# Altium schematic sheet [02]_Sensors Sheet.SchDoc
size 457 x 254 mm; DocumentNumber: 2; SheetNumber: 2; SheetTotal: 5
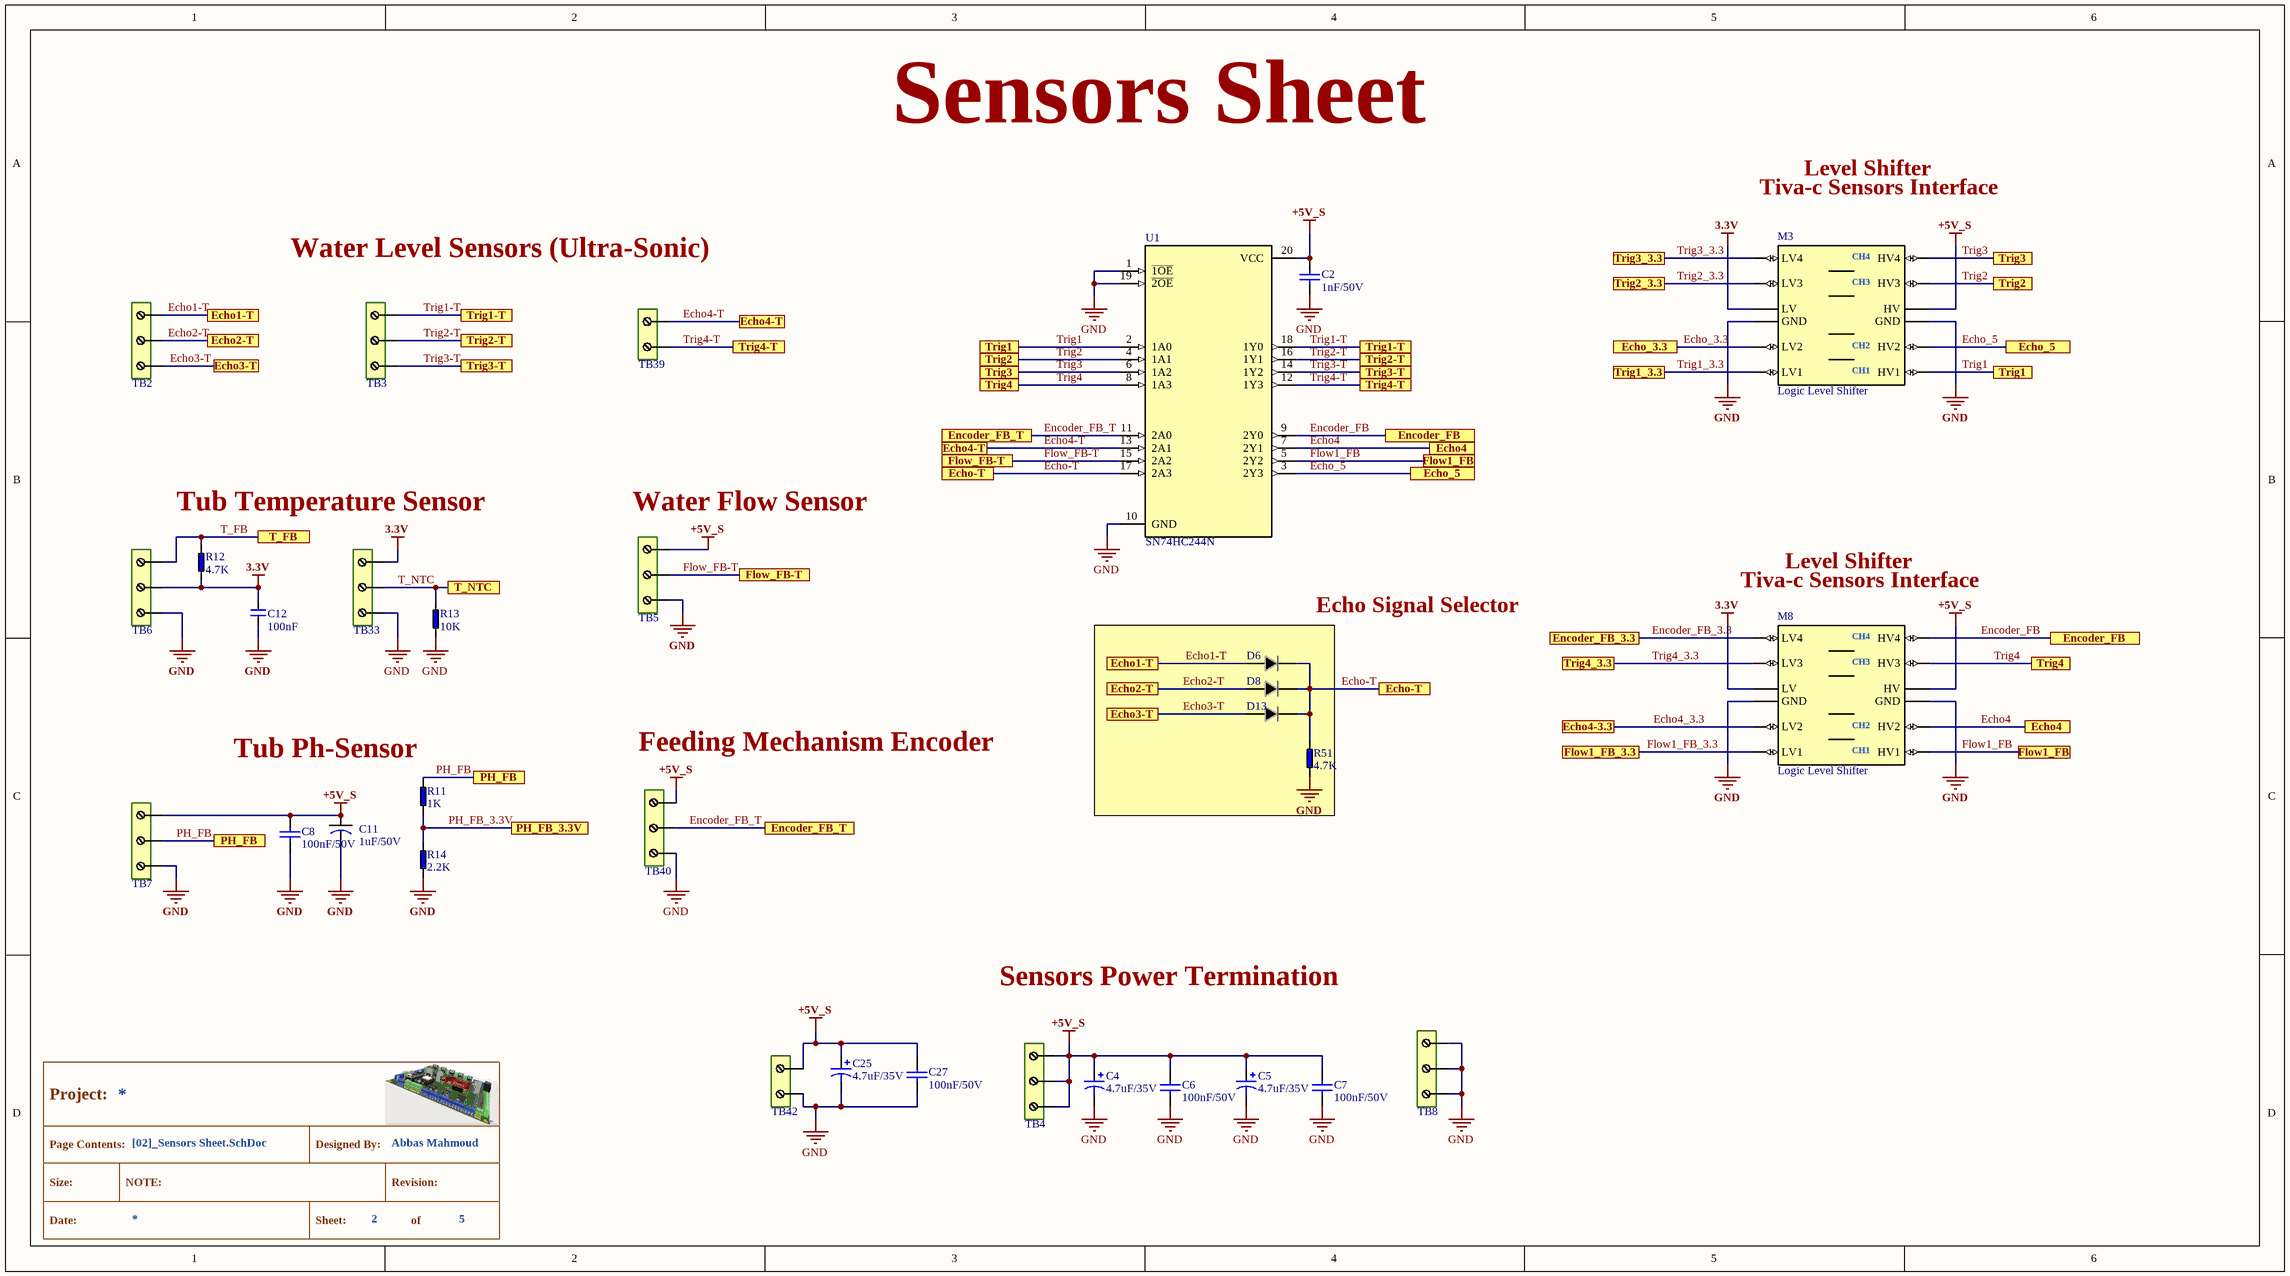
[diagram p0: [02]_Sensors Sheet.SchDoc]

## Parts
*  Title Block  (value not drawn)  (graphical)
C2  1nF/50V  [CCAP - PACKAGE - THT ,P = 2.54 MM]
C4  4.7uF/35V  [ECAP - THT - 5X11X2MM]
C5  4.7uF/35V  [ECAP - THT - 5X11X2MM]
C6  100nF/50V  [CCAP - PACKAGE - THT ,P = 2.54 MM]
C7  100nF/50V  [CCAP - PACKAGE - THT ,P = 2.54 MM]
C8  100nF/50V  [CCAP - PACKAGE - THT ,P = 2.54 MM]
C11  1uF/50V  [ECAP 5X11X2MM]
C12  100nF  [CCAP 0.1 N Y]
C25  4.7uF/35V  [ECAP - THT - 5X11X2MM]
C27  100nF/50V  [CCAP - PACKAGE - THT ,P = 2.54 MM]
D6  1N4007  [DIODE - THT - 2.54P - PACKAGE - DO-41]  (value not drawn)
D8  1N4007  [DIODE - THT - 2.54P - PACKAGE - DO-41]  (value not drawn)
D13  1N4007  [DIODE - THT - 2.54P - PACKAGE - DO-41]  (value not drawn)
M3  Logic Level Shifter  [Logic Level Shifter]
M8  Logic Level Shifter  [Logic Level Shifter]
R11  1K  [R-THT_5.08mm-1/4W]
R12  4.7K  [R-THT_5.08mm-1/4W]
R13  10K  [R - THT - P5.0 - 1/4W]
R14  2.2K  [R-THT_5.08mm-1/4W]
R51  4.7K  [R-THT_5.08mm-1/4W]
TB2  3 Pins Pluggable  [TERMINAL BLOCK - 3 PINS - PACKAGE - PLUGGABLE - THT - P = 5.08MM - Vertical _ PLUG+RECEPTABLE]  (value not drawn)
TB3  3 Pins Pluggable  [TERMINAL BLOCK - 3 PINS - PACKAGE - PLUGGABLE - THT - P = 5.08MM - HORIZONTAL _ PLUG+RECEPTABLE]  (value not drawn)
TB4  3 Pins Pluggable  [TERMINAL BLOCK - 3 PINS - PACKAGE - PLUGGABLE - THT - P = 5.08MM - Vertical _ PLUG+RECEPTABLE]  (value not drawn)
TB5  3 Pins Pluggable  [TERMINAL BLOCK - 3 PINS - PACKAGE - PLUGGABLE - THT - P = 5.08MM - HORIZONTAL _ PLUG+RECEPTABLE]  (value not drawn)
TB6  3 Pins Pluggable  [TERMINAL BLOCK - 3 PINS - PACKAGE - PLUGGABLE - THT - P = 5.08MM - Vertical _ PLUG+RECEPTABLE]  (value not drawn)
TB7  3 Pins Pluggable  [TERMINAL BLOCK - 3 PINS - PACKAGE - PLUGGABLE - THT - P = 5.08MM - Vertical _ PLUG+RECEPTABLE]  (value not drawn)
TB8  3 Pins Pluggable  [TERMINAL BLOCK - 3 PINS - PACKAGE - PLUGGABLE - THT - P = 5.08MM - HORIZONTAL _ PLUG+RECEPTABLE]  (value not drawn)
TB33  3 Pins Pluggable  [TERMINAL BLOCK - 3 PINS - PACKAGE - PLUGGABLE - THT - P = 5.08MM - HORIZONTAL _ PLUG+RECEPTABLE]  (value not drawn)
TB39  2 Pins Pluggable  [TERMINAL BLOCK - 2 PINS - PACKAGE - PLUGGABLE - THT - P = 5.08MM - Horizontal _ Plug+Receptable]  (value not drawn)
TB40  3 Pins Pluggable  [TERMINAL BLOCK - 3 PINS - PACKAGE - PLUGGABLE - THT - P = 5.08MM - Vertical _ PLUG+RECEPTABLE]  (value not drawn)
TB42  2 Pins Pluggable  [TERMINAL BLOCK - 2 PINS - PACKAGE - PLUGGABLE - THT - P = 5.08MM - Horizontal _ Plug+Receptable]  (value not drawn)
U1  SN74HC244N  [ICB - DIP-20]

## Blocks framed on the sheet
Echo Signal Selector: D6 D8 D13 R51

## Ports
Echo1-T, Echo2-T, Echo3-T, Echo4, Echo4-3.3, Echo4-T, Echo-T, Echo_3.3, Echo_5, Encoder_FB, Encoder_FB_3.3, Encoder_FB_T, Flow1_FB, Flow1_FB_3.3, Flow_FB-T, PH_FB, PH_FB_3.3V, T_FB, T_NTC, Trig1, Trig1-T, Trig1_3.3, Trig2, Trig2-T, Trig2_3.3, Trig3, Trig3-T, Trig3_3.3, Trig4, Trig4-T, Trig4_3.3

## Nets
3.3V: C12.1 M3.9(LV) M8.9(LV) R12.2 TB6.2 TB33.3
+5V_S: C2.1 C4.A C5.A C6.1 C7.1 C8.1 C11.A C25.A C27.1 M3.4(HV) M8.4(HV) TB4.1 TB4.2 TB4.3 TB5.3 TB7.3 TB40.3 TB42.2 U1.20(VCC)
GND: C2.2 C4.K C5.K C6.2 C7.2 C8.2 C11.K C12.2 C25.K C27.2 M3.3(GND) M3.10(GND) M8.3(GND) M8.10(GND) R13.1 R14.1 R51.1 TB5.1 TB6.1 TB7.1 TB8.1 TB8.2 TB8.3 TB33.1 TB40.1 TB42.1 U1.1(~{1OE}) U1.10(GND) U1.19(~{2OE})
Echo1-T: D6.A TB2.3 ; port Echo1-T
Echo2-T: D8.A TB2.2 ; port Echo2-T
Echo3-T: D13.A TB2.1 ; port Echo3-T
Echo4: M8.5(HV2) U1.7(2Y1) ; port Echo4
Echo4-T: TB39.2 U1.13(2A1) ; port Echo4-T
Echo4_3.3: M8.8(LV2) ; port Echo4-3.3
Echo-T: D6.K D8.K D13.K R51.2 U1.17(2A3) ; port Echo-T
Echo_3.3: M3.8(LV2) ; port Echo_3.3
Echo_5: M3.5(HV2) U1.3(2Y3) ; port Echo_5
Encoder_FB: M8.1(HV4) U1.9(2Y0) ; port Encoder_FB
Encoder_FB_3.3: M8.12(LV4) ; port Encoder_FB_3.3
Encoder_FB_T: TB40.2 U1.11(2A0) ; port Encoder_FB_T
Flow1_FB: M8.6(HV1) U1.5(2Y2) ; port Flow1_FB
Flow1_FB_3.3: M8.7(LV1) ; port Flow1_FB_3.3
Flow_FB-T: TB5.2 U1.15(2A2) ; port Flow_FB-T
PH_FB: R11.2 TB7.2 ; port PH_FB
PH_FB_3.3V: R11.1 R14.2 ; port PH_FB_3.3V
T_FB: R12.1 TB6.3 ; port T_FB
T_NTC: R13.2 TB33.2 ; port T_NTC
Trig1: M3.6(HV1) U1.2(1A0) ; port Trig1
Trig1-T: TB3.3 U1.18(1Y0) ; port Trig1-T
Trig1_3.3: M3.7(LV1) ; port Trig1_3.3
Trig2: M3.2(HV3) U1.4(1A1) ; port Trig2
Trig2-T: TB3.2 U1.16(1Y1) ; port Trig2-T
Trig2_3.3: M3.11(LV3) ; port Trig2_3.3
Trig3: M3.1(HV4) U1.6(1A2) ; port Trig3
Trig3-T: TB3.1 U1.14(1Y2) ; port Trig3-T
Trig3_3.3: M3.12(LV4) ; port Trig3_3.3
Trig4: M8.2(HV3) U1.8(1A3) ; port Trig4
Trig4-T: TB39.1 U1.12(1Y3) ; port Trig4-T
Trig4_3.3: M8.11(LV3) ; port Trig4_3.3

## Notes on the sheet
- Sensors Sheet
- Tiva-c Sensors Interface
- Level Shifter
- Water Level Sensors (Ultra-Sonic)
- Tub Temperature Sensor
- (near TB5) Water Flow Sensor
- (near M8) Tiva-c Sensors Interface
- (near R11) Tub Ph-Sensor
- (near TB40) Feeding Mechanism Encoder
- Sensors Power Termination
- (in symbol Logic Level Shifter) CH4; CH3; CH2; CH1
- (in symbol Title Block) Project:; Page Contents:; Designed By:; Abbas Mahmoud; Size:; NOTE:; Revision:; Date:; Sheet:; of

## Library data of the parts
* = Title Block: Moatley Title Block
C2 = CCAP - 1nF - 50V - THT - P = 2.54: 1nF ±20% 50V Through Hole,P=2.54mm Ceramic Disc Capacitors RoHS; Parameter 1: *; Parameter 2: *; Parameter 3: *
C4 C5 C25 = ECAP - 4.7uF - 35V: 4.7uF ±20% 35V 5x11 7000Hrs @ 105℃ Radial,5x11mm Aluminum Electrolytic Capacitors - Leaded RoHS
C6-C8 C27 = CCAP - 100nF - 50V - THT - P = 2.54: 100nF -20%~+80% 50V Through Hole,P=2.54mm Ceramic Disc Capacitors RoHS; Parameter 1: *; Parameter 2: *; Parameter 3: *
C11 = ECAP-1uF-50V: 1uF ±20% 50V 5x11 1000Hrs @ 105℃ Radial,5x11mm Aluminum Electrolytic Capacitors - Leaded RoHS
C12 = Ceramic_CAP_100nF
D6 D8 D13 = Diode - 1N4007 - THT: 1kV 1A 1V @ 1A DO-41 Diodes - General Purpose RoHS
M3 M8 = Logic Level Shifter: Logic Level Converter Bi-Directional - Works with 5V / 3.3V / 2.8V / 1.8V
R11 = R1K-THT: 1K ±1% 1/4W ±100ppm/℃ Axial Metal Film Resistor_ Throuh Hole Technology RoHS
R12 R51 = R4.7K-THT: 4.7K ±1% 1/4W ±100ppm/℃ Axial Metal Film Resistor_ Throuh Hole Technology RoHS
R13 = R10K - THT: 10K ±1% 1/4W ±100ppm/℃ Axial Metal Film Resistor_ Throuh Hole Technology RoHS
R14 = R2.2K-THT: 2.2K ±1% 1/4W ±100ppm/℃ Axial Metal Film Resistor_ Throuh Hole Technology RoHS
TB2 TB4 TB6 TB7 TB40 = Terminal Block - 3 Pins - Pluggable - Vertical: Terminal Block 3 Pin 15A 300V  (28-14 AWG) P=5.08mm Through Hole Pluggable System Terminal Block RoHS
TB3 TB5 TB8 TB33 = Terminal Block - 3 Pins - Pluggable: Terminal Block 3 Pin 15A 300V  (28-14 AWG) P=5.08mm Through Hole Pluggable System Terminal Block RoHS
TB39 TB42 = Terminal Block - 2 Pins - Pluggable: Terminal Block 2 Pin 15A 300V  (28-14 AWG) P=5.08mm Through Hole Pluggable System Terminal Block RoHS
U1 = IC - SN74HC244N: 74HC Buffers,Non-Opposite Side DIP-20 Logic-Buffers, Drivers, Receivers, Transceivers RoHS